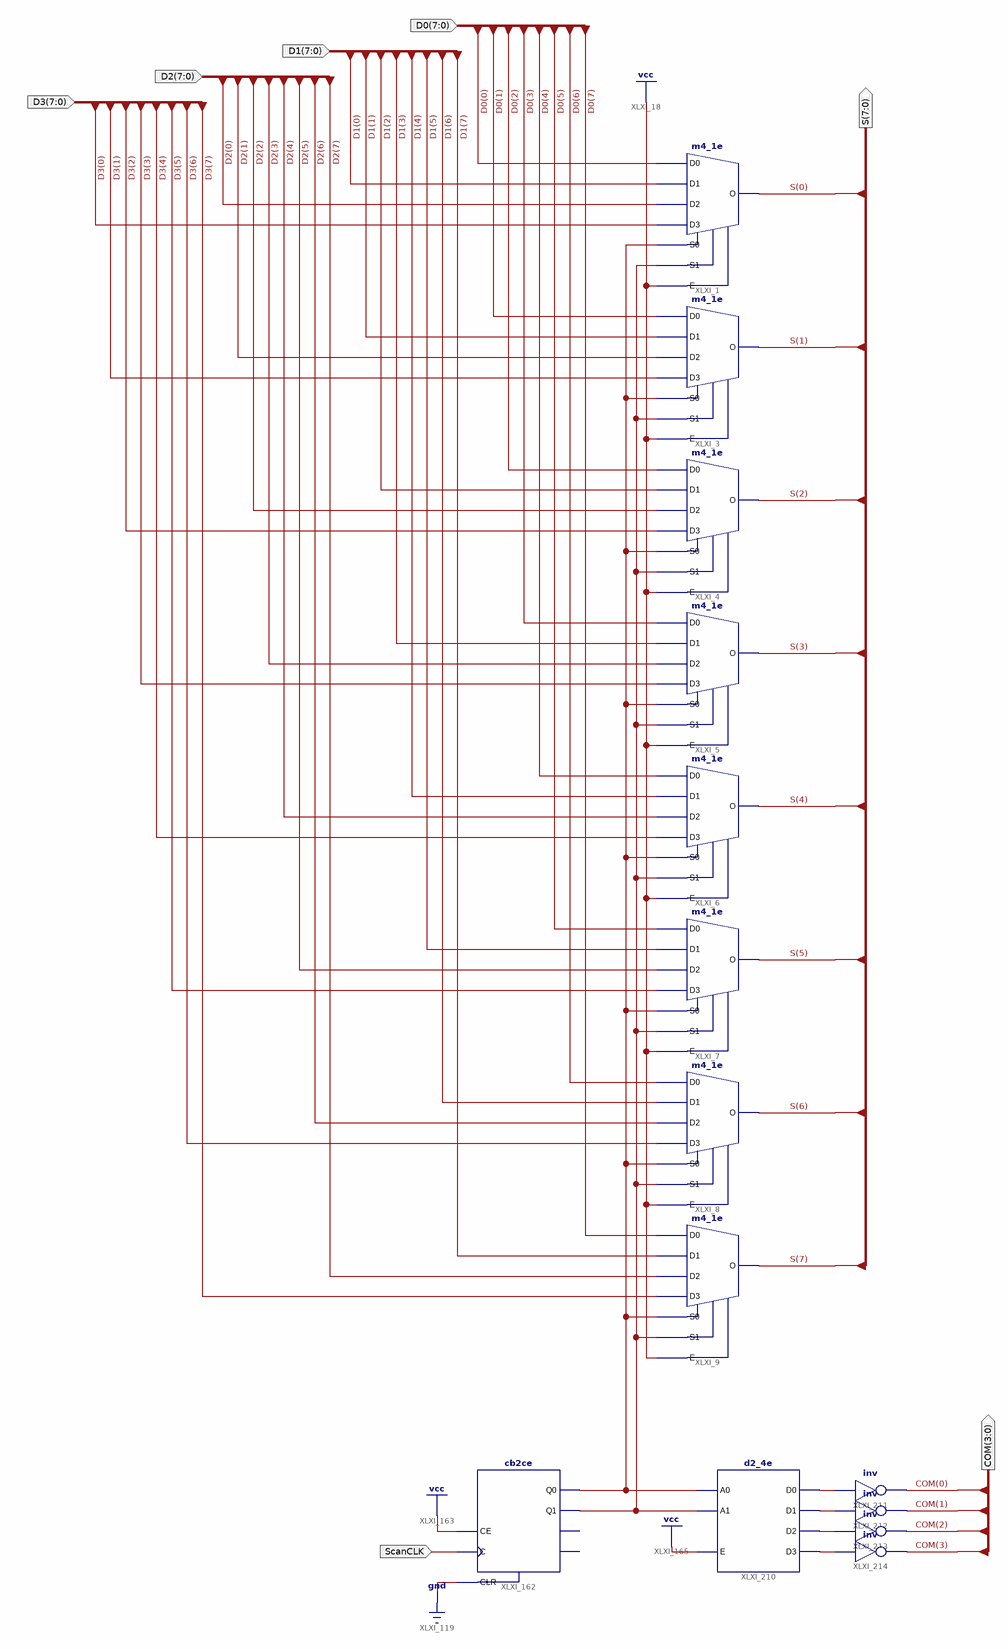
[diagram p0: schematic sheet 1]
// Xilinx ISE schematic ssd4drbp.sch (spartan6) as structural Verilog: 14 symbols, 7 ports
module ssd4drbp (
  input  [7:0] D3,
  input  [7:0] D2,
  input  [7:0] D1,
  input  [7:0] D0,
  input  ScanCLK,
  output [3:0] COM,
  output [7:0] S
);

  wire XLXN_28, XLXN_29, XLXN_236, XLXN_237, XLXN_238, XLXN_239;

  m4_1e XLXI_1 (.D0(D0[0]), .D1(D1[0]), .D2(D2[0]), .D3(D3[0]), .E(1'b1), .S0(XLXN_29), .S1(XLXN_28), .O(S[0]));
  m4_1e XLXI_3 (.D0(D0[1]), .D1(D1[1]), .D2(D2[1]), .D3(D3[1]), .E(1'b1), .S0(XLXN_29), .S1(XLXN_28), .O(S[1]));
  m4_1e XLXI_4 (.D0(D0[2]), .D1(D1[2]), .D2(D2[2]), .D3(D3[2]), .E(1'b1), .S0(XLXN_29), .S1(XLXN_28), .O(S[2]));
  m4_1e XLXI_5 (.D0(D0[3]), .D1(D1[3]), .D2(D2[3]), .D3(D3[3]), .E(1'b1), .S0(XLXN_29), .S1(XLXN_28), .O(S[3]));
  m4_1e XLXI_6 (.D0(D0[4]), .D1(D1[4]), .D2(D2[4]), .D3(D3[4]), .E(1'b1), .S0(XLXN_29), .S1(XLXN_28), .O(S[4]));
  m4_1e XLXI_7 (.D0(D0[5]), .D1(D1[5]), .D2(D2[5]), .D3(D3[5]), .E(1'b1), .S0(XLXN_29), .S1(XLXN_28), .O(S[5]));
  m4_1e XLXI_8 (.D0(D0[6]), .D1(D1[6]), .D2(D2[6]), .D3(D3[6]), .E(1'b1), .S0(XLXN_29), .S1(XLXN_28), .O(S[6]));
  m4_1e XLXI_9 (.D0(D0[7]), .D1(D1[7]), .D2(D2[7]), .D3(D3[7]), .E(1'b1), .S0(XLXN_29), .S1(XLXN_28), .O(S[7]));
  cb2ce XLXI_162 (.C(ScanCLK), .CE(1'b1), .CLR(1'b0), .Q0(XLXN_29), .Q1(XLXN_28));  // open: CEO, TC
  d2_4e XLXI_210 (.A0(XLXN_29), .A1(XLXN_28), .E(1'b1), .D0(XLXN_236), .D1(XLXN_237), .D2(XLXN_238), .D3(XLXN_239));
  not XLXI_211 (COM[0], XLXN_236);
  not XLXI_212 (COM[1], XLXN_237);
  not XLXI_213 (COM[2], XLXN_238);
  not XLXI_214 (COM[3], XLXN_239);
endmodule
